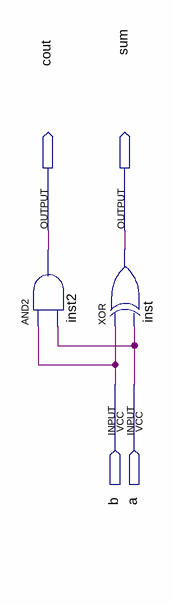
[diagram p0: schematic sheet]
// Quartus schematic 1bithalfadder.bdf as structural Verilog: 2 symbols, 4 pins
module \1bithalfadder  (
  input  b,
  input  a,
  output cout,
  output sum
);

  and inst2 (cout, b, a);
  xor inst (sum, b, a);
endmodule
